# Altium project Fri3D_IRA_01.PrjPcb
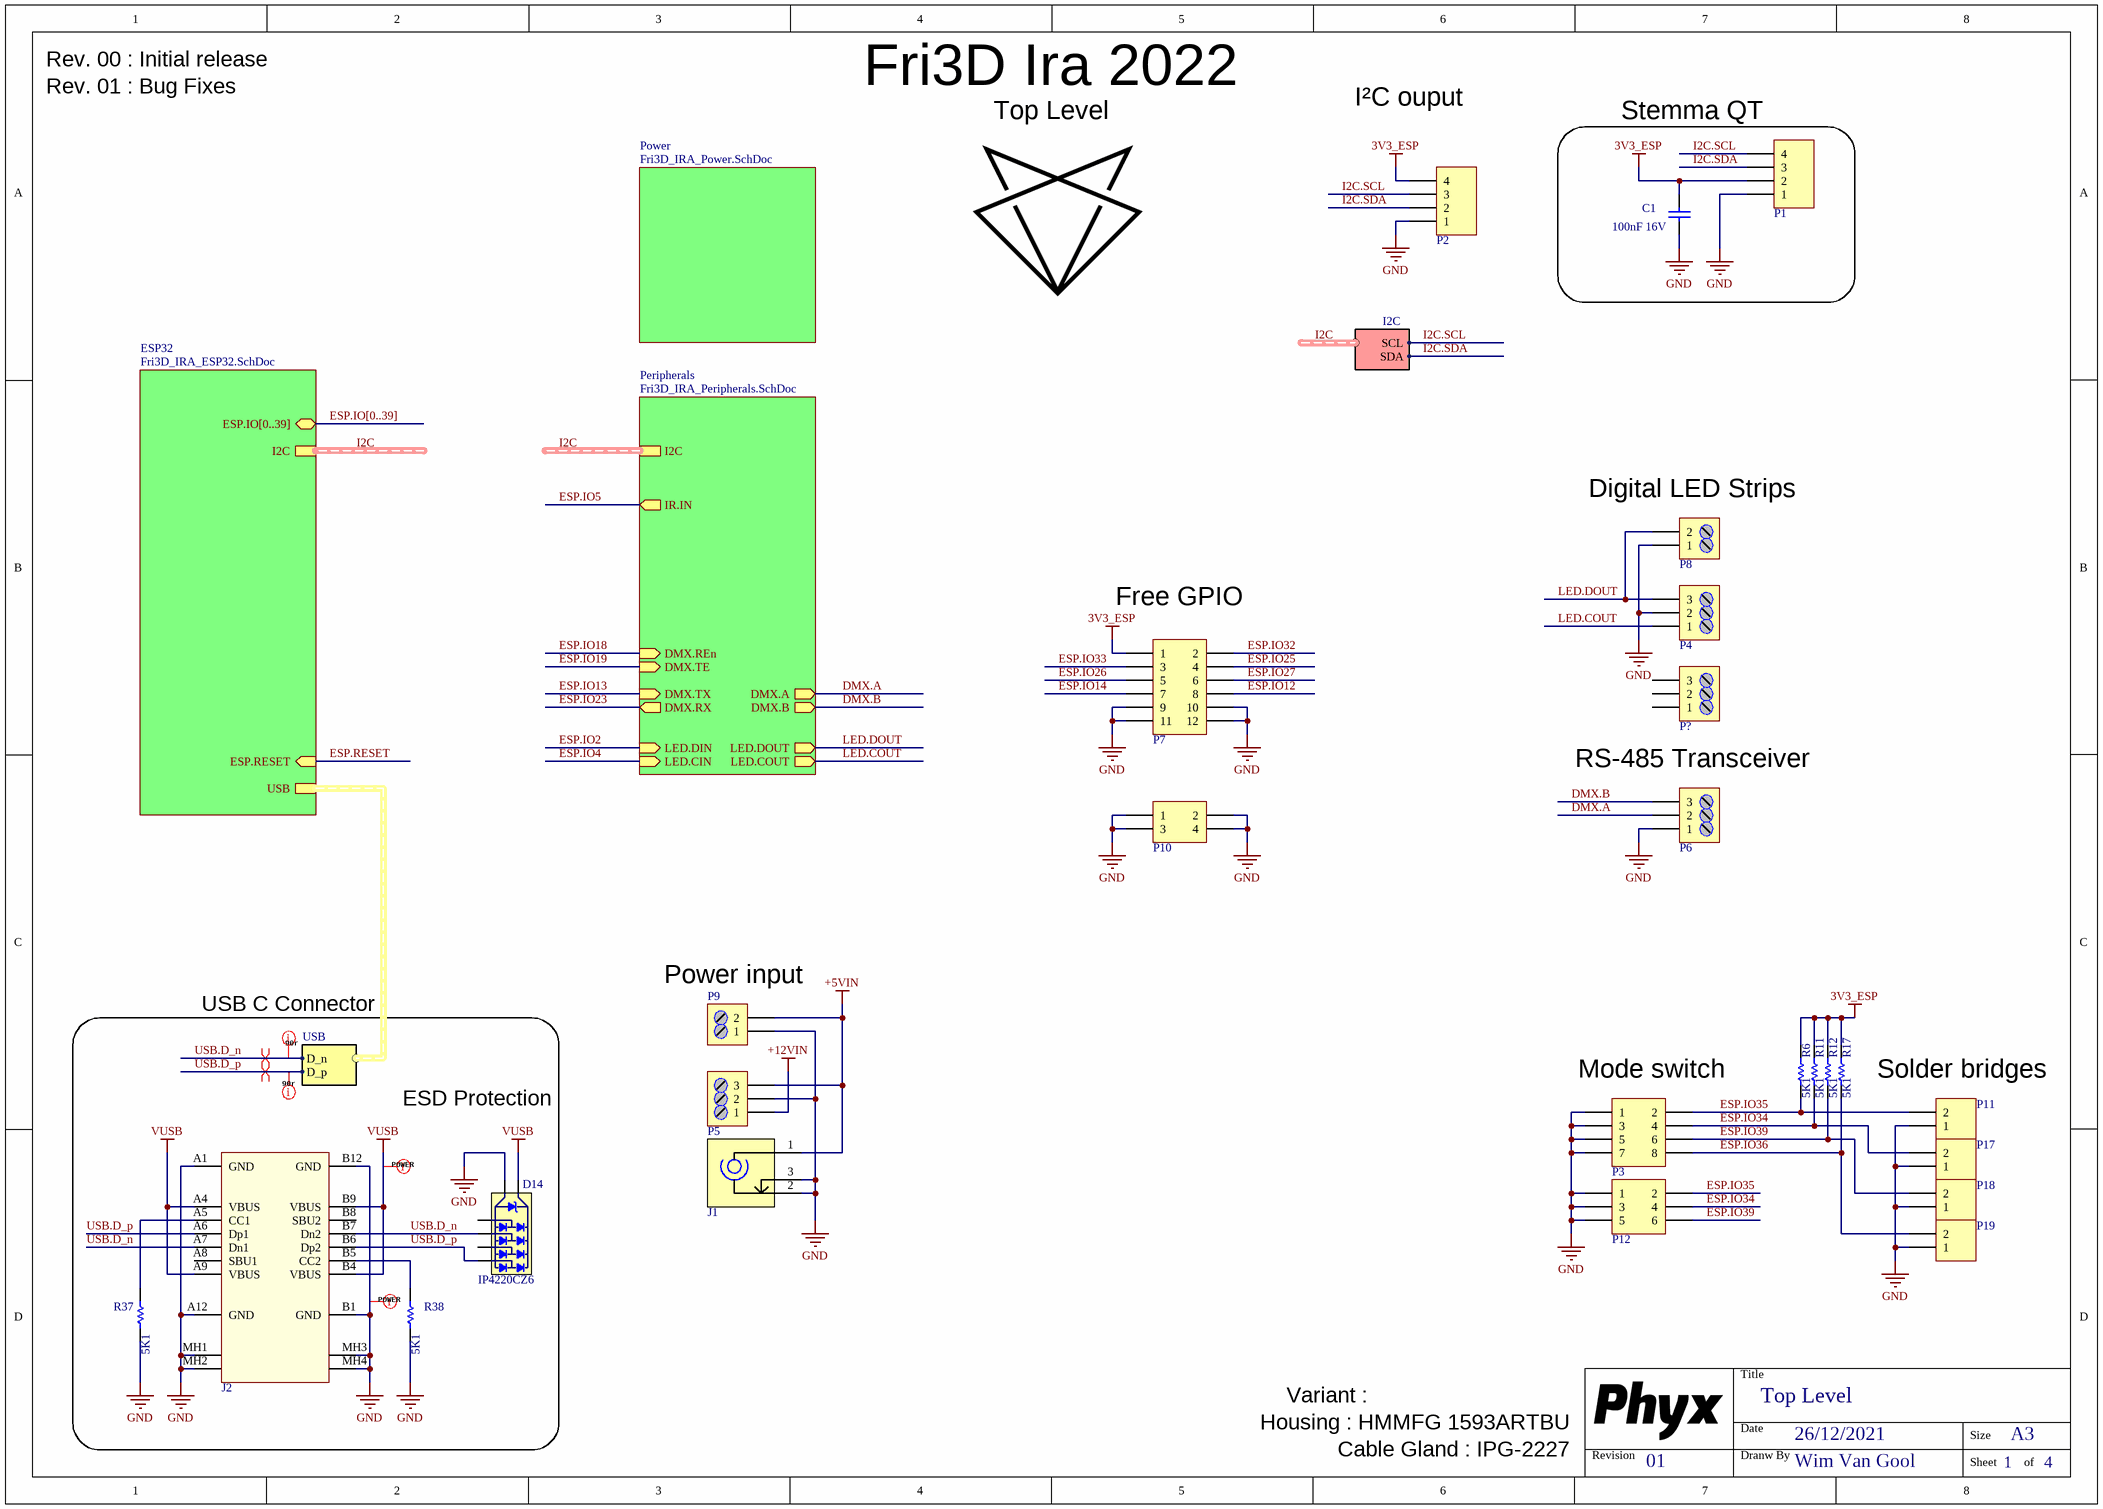
[diagram p0: Fri3D_IRA_01.SchDoc]
PCB_ENGINEER: WimVG; PCB_REV: 01; PCB_TITLE: Fri3D Ira 2022
4 sheets, 87 parts. Net scope: hierarchical (ports join the sheet entries above them; power ports are global).
Board file: Fri3D_IRA_01.PcbDoc
Sheets:
  Fri3D_IRA_01.SchDoc
    Peripherals = Fri3D_IRA_Peripherals.SchDoc
    Power = Fri3D_IRA_Power.SchDoc
    ESP32 = Fri3D_IRA_ESP32.SchDoc

## Sheet Fri3D_IRA_01.SchDoc: Top Level
size A3; Date: 26/12/2021; DrawnBy: Wim Van Gool; DocumentNumber: 1; Revision: 01; SheetNumber: 1; SheetTotal: 4

### Parts
C1  value 100nF 16V  [C0603_N]
D14  value IP4220CZ6  [NXP_SOT457]  (hidden comment: TVS Diode Dual USB)
J1  Socket RA 5.5  with 2.5 barrel  [Cliff_DC10]  (value not drawn)
J2  USB 2.0 C Reversible Receptacle Horizontal  [HRO_TYPE-C-31-M-12]  (value not drawn)
P1  Header 1.0mm RA Shrouded 4  [WE_665104131822]  (value not drawn)
P2  Header 4  [HDR1X4]  (value not drawn)
P3  Header 4x2  [HDR2X4]  (value not drawn)
P4  3 Way Screw HDR 3.5mm Rising Cage  [WE_691103110003]  (value not drawn)
P5  3 Way Screw HDR 5,08mm  [TERM_BLK-0508-3-90]  (value not drawn)
P6  3 Way Screw HDR 3.5mm Rising Cage  [WE_691103110003]  (value not drawn)
P7  Header 6X2  [HDR2X6]  (value not drawn)
P8  2 Way Screw HDR 3.5mm Rising Cage  [WE_691103110002]  (value not drawn)
P9  2 Way Screw HDR 5,08mm  [TERM_BLK-0508-2-90]  (value not drawn)
P10  Header 2X2  [HDR2X2]  (value not drawn)
P11  Easy to solder connection  [SOLDER_SW_V_1MM]  (value not drawn)
P12  Header 3X2  [HDR2X3_SMD]  (value not drawn)
P17  Easy to solder connection  [SOLDER_SW_V_1MM]  (value not drawn)
P18  Easy to solder connection  [SOLDER_SW_V_1MM]  (value not drawn)
P19  Easy to solder connection  [SOLDER_SW_V_1MM]  (value not drawn)
P?  3 Way Screw HDR 3.5mm Rising Cage  [WE_691103110003]  (value not drawn)
R6  value 5K1  [R0603_N]  (hidden comment: RESISTOR)
R11  value 5K1  [R0603_N]  (hidden comment: RESISTOR)
R12  value 5K1  [R0603_N]  (hidden comment: RESISTOR)
R17  value 5K1  [R0603_N]  (hidden comment: RESISTOR)
R37  value 5K1  [R0603_N]  (hidden comment: RESISTOR)
R38  value 5K1  [R0603_N]  (hidden comment: RESISTOR)

### Blocks framed on the sheet
Stemma QT: C1 P1

### Sub-sheets
ESP32 = Fri3D_IRA_ESP32.SchDoc: I2C (harness I2C), USB (harness USB), ESP.RESET (in), ESP.IO[0..39] (bidir)
Peripherals = Fri3D_IRA_Peripherals.SchDoc: LED.DIN (in), LED.DOUT (out), IR.IN (out), DMX.RX (out), DMX.A (out), DMX.B (out), LED.CIN (in), LED.COUT (out), DMX.TX (in), DMX.REn (in), DMX.TE (in), I2C (harness I2C)
Power = Fri3D_IRA_Power.SchDoc: no entries

### Harnesses
USB: D_p, D_n
I2C: SDA, SCL

### Nets
3V3_ESP: C1.1 P1.2 P2.4 P7.1 R6.1 R11.1 R12.1 R17.1
+5VIN: J1.1 P5.3 P9.2
+12VIN: P5.1
GND: C1.2 D14.2(GND) J1.2 J1.3 J2.A1(GND) J2.A12(GND) J2.B1(GND) J2.B12(GND) J2.MH1(Tab) J2.MH2(Tab) J2.MH3(Tab) J2.MH4(Tab) P1.1 P2.1 P3.1 P3.3 P3.5 P3.7 P4.2 P5.2 P6.1 P7.9 P7.10 P7.11 P7.12 P8.1 P9.1 P10.1 P10.2 P10.3 P10.4 P11.1 P12.1 P12.3 P12.5 P17.1 P18.1 P19.1 R37.2 R38.2
VUSB: D14.5(VBus) J2.A4(VBUS) J2.A9(VBUS) J2.B4(VBUS) J2.B9(VBUS)
DMX.A: P6.2 ; sheet Peripherals/DMX.A
DMX.B: P6.3 ; sheet Peripherals/DMX.B
ESP.IO12: P7.8
ESP.IO14: P7.7
ESP.IO25: P7.4
ESP.IO26: P7.5
ESP.IO27: P7.6
ESP.IO32: P7.2
ESP.IO33: P7.3
ESP.IO34: P3.4 P12.4 P17.2 R11.2
ESP.IO35: P3.2 P11.2 P12.2 R6.2
ESP.IO36: P3.8 P19.2 R17.2
ESP.IO39: P3.6 P12.6 P18.2 R12.2
I2C.SCL: P1.4 P2.3 ; sheet Peripherals/I2C.SCL
I2C.SDA: P1.3 P2.2 ; sheet Peripherals/I2C.SDA
LED.COUT: P4.1 ; sheet Peripherals/LED.COUT
LED.DOUT: P4.3 P8.2 ; sheet Peripherals/LED.DOUT
USB.D_n: D14.1 J2.A7(Dn1) J2.B7(Dn2) ; sheet ESP32/USB.D_n
USB.D_p: D14.6 J2.A6(Dp1) J2.B6(Dp2) ; sheet ESP32/USB.D_p
NetJ2_A5: J2.A5(CC1) R37.1
NetJ2_B5: J2.B5(CC2) R38.1

Not connected (* = marked no-connect by the designer): D14 3 4; J2 A8(SBU1) B8(SBU2); P? 1 2 3

### Buses and harness runs
bus ESP.IO[0..39] = sheet ESP32/ESP.IO[0..39]
harness I2C = sheet ESP32/I2C
harness I2C = sheet Peripherals/I2C

### Layout directives
net class 90r: USB.D_n, USB.D_p
differential pair: USB.D_n, USB.D_p
net class POWER: GND, VUSB

### Notes on the sheet
- Rev. 00 : Initial release
- Rev. 01 : Bug Fixes
- I²C ouput
- (near P8) Digital LED Strips
- (near P7) Free GPIO
- RS-485 Transceiver
- (near P9) Power input
- USB C Connector
- ESD Protection
- (near P3) Mode switch
- Solder bridges
- Variant :
- Housing : HMMFG 1593ARTBU
- Cable Gland : IPG-2227
- Title
- Revision
- Date
- Dranw By
- Size
- A3
- Sheet
- of

### Library data of the parts
C1 = CAP # 100nF 16V 0603: Capacitor Ceramic
D14 = TVS # IP4220CZ6 Dual USB: =Description; Supplier 1: Farnell; Supplier Part Number 1: 2143248
J1 = SCKT 2.5mm barrel: =Description; Value: Cliff_DC10B; Supplier 1: Farnell; Supplier Part Number 1: 224960
J2 = USB # C 2.0 RCPT TYPE-C-31-M-12: Value: TYPE-C-31-M-12; Supplier 1: China; Supplier Part Number 1: HRO TYPE-C-31-M-12; Supplier 2: LCSC; Supplier Part Number 2: C165948; Supplier 3: LCSC ALT; Supplier Part Number 3: C167321 / C319148
P1 = HDR # RA SHR 1.0mm 4way - 665104131822: Value: 665104131822; Supplier 1: Wurth; Supplier Part Number 1: 665104131822; Supplier 2: Mouser; Supplier Part Number 2: 710-665104131822
P2 = Pin Header 2.54mm 4way
P3 = Pin Header 2.54mm dual row 8way
P4 P6 P? = Terminal Block 3.5mm 3way: Supplier 1: LCSC; Description: Terminal Block 3.5mm 3way; Supplier Part Number 1: C784941; Supplier 2: Würth; Supplier Part Number 2: 691214110003
P5 = Terminal Block 5.08mm 3way: Value: PM5.08/3/90; Supplier 1: Farnell
P7 = Pin Header 2.54mm dual row 12way
P8 = Terminal Block 3.5mm 2way: Supplier 1: LCSC; Supplier Part Number 1: C784940; Description: Terminal Block 3.5mm 2way; Supplier 2: Würth; Supplier Part Number 2: 691214110002
P9 = Terminal Block 5.08mm 2way: Value: PM5.08/2/90; Supplier 1: Farnell; Supplier Part Number 1: 1131853
P10 = Pin Header 2.54mm dual row 4way
P11 P17-P19 = SOLDER SW V 1MM: Value: NO BOM
P12 = Pin Header # 2.54mm dual row 6way: Supplier 1: LCSC; Supplier Part Number 1: C192301; Supplier 2: LCSC; Supplier Part Number 2: C124390
R6 R11 R12 R17 R37 R38 = RES # 5K1 0603: Supplier 1: Farnell; Supplier Part Number 1: 2845922

## Sheet Fri3D_IRA_Peripherals.SchDoc: Peripherals
size A3; Date: 26/12/2021; DrawnBy: Wim Van Gool; DocumentNumber: 3; Revision: 01; SheetNumber: 3; SheetTotal: 4
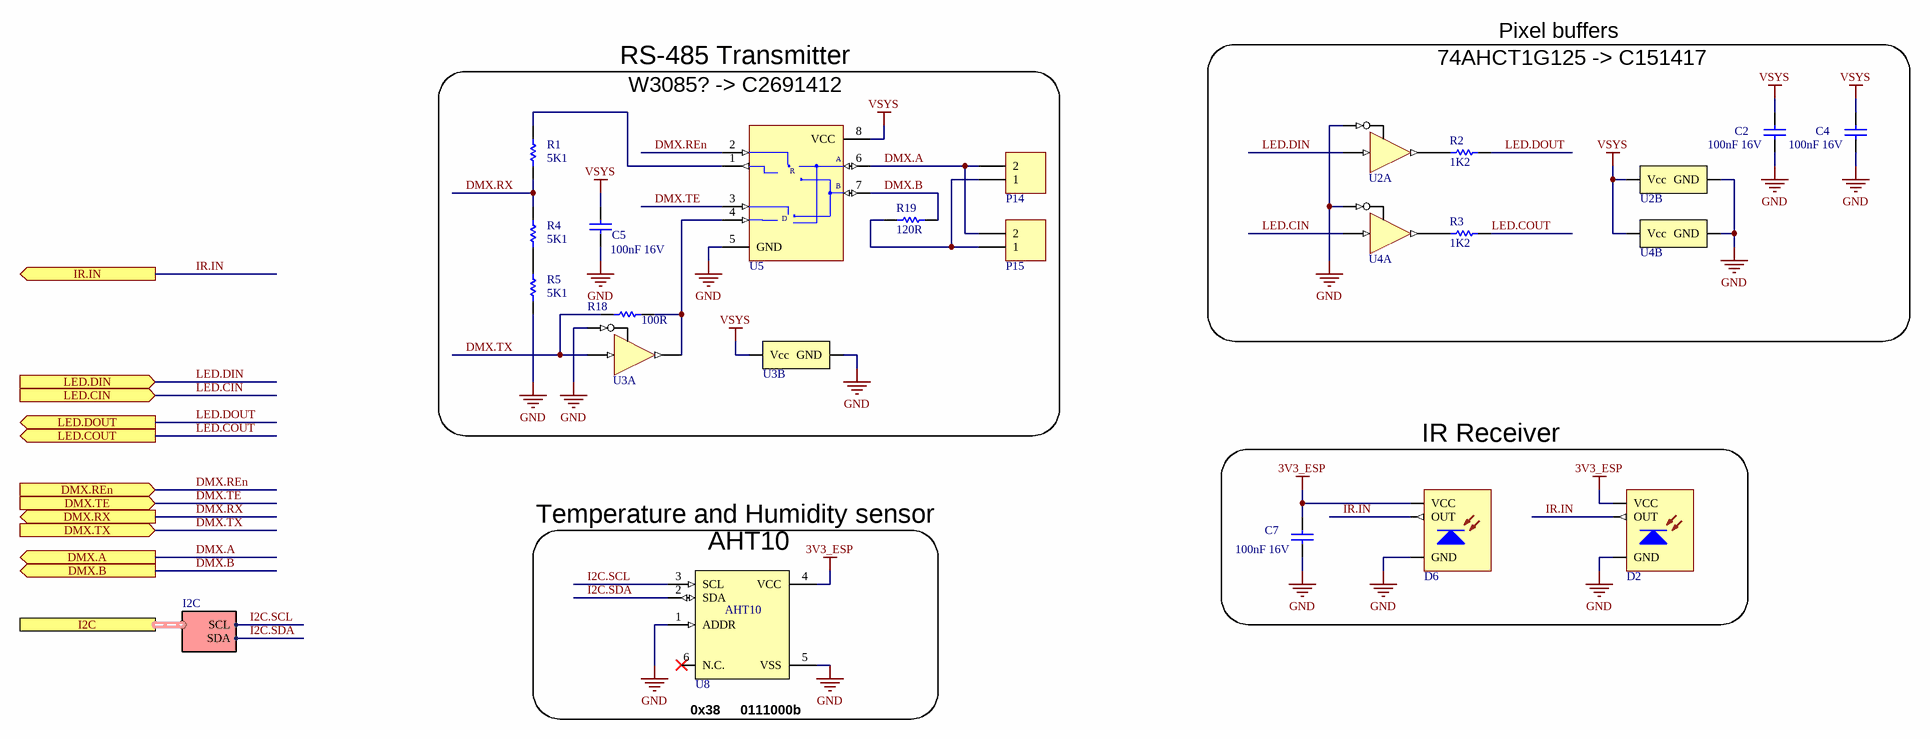
[diagram p1: Fri3D_IRA_Peripherals.SchDoc]

### Parts
C2  value 100nF 16V  [C0603_N]
C4  value 100nF 16V  [C0603_N]
C5  value 100nF 16V  [C0603_N]
C7  value 100nF 16V  [C0603_N]
D2  ZIRM-5042B-42-Z2 Infrared Receiver 38 kHz 45° 2.7-5.5V 940nm  [CHAU_ZIRM-5042B-42-Z2]  (value not drawn)
D6  IRM-3638N3F14 Infrared Receiver 38 kHz 45° 2.7-5.5V  [VIS_TSOP381x_BENT]  (value not drawn)
P14  Easy to solder connection  [SOLDER_SW_V_1MM]  (value not drawn)
P15  Header 2  [HDR1X2]  (value not drawn)
R1  value 5K1  [R0603_N]  (hidden comment: RESISTOR)
R2  value 1K2  [R0603_N]  (hidden comment: RESISTOR)
R3  value 1K2  [R0603_N]  (hidden comment: RESISTOR)
R4  value 5K1  [R0603_N]  (hidden comment: RESISTOR)
R5  value 5K1  [R0603_N]  (hidden comment: RESISTOR)
R18  value 100R  [R0603_N]  (hidden comment: RESISTOR)
R19  value 120R  [R1206]  (hidden comment: RESISTOR)
U2  SN74AHCT1G125DCKR  Buffer, Tri-State, 4.5V to 5.5V  [TI_DCK_R-PDSO-G5]  (value not drawn)  (parts A,B of 2)
U3  SN74AHCT1G125DCKR  Buffer, Tri-State, 4.5V to 5.5V  [TI_DCK_R-PDSO-G5]  (value not drawn)  (parts A,B of 2)
U4  SN74AHCT1G125DCKR  Buffer, Tri-State, 4.5V to 5.5V  [TI_DCK_R-PDSO-G5]  (value not drawn)  (parts A,B of 2)
U5  RS-485 5V Transceiver  [SOIC_N_8]  (value not drawn)
U8  AHT 10 Temperature and humidity sensor  [AHT10]  (value not drawn)

### Blocks framed on the sheet
RS-485 Transmitter: C5 P14 P15 R1 R4 R5 R18 R19 U3 U5
IR Receiver: C7 D2 D6

### Ports
DMX.A (out), DMX.B (out), DMX.REn (in), DMX.RX (out), DMX.TE (in), DMX.TX (in), I2C (harness I2C), IR.IN (out), LED.CIN (in), LED.COUT (out), LED.DIN (in), LED.DOUT (out)

### Harnesses
I2C: SDA, SCL

### Nets
3V3_ESP: C7.1 D2.3(VCC) D6.3(VCC) U8.4(VCC)
GND: C2.2 C4.2 C5.2 C7.2 D2.2(GND) D6.2(GND) R5.2 U2.1(~{OE}) U2.3(GND) U3.1(~{OE}) U3.3(GND) U4.1(~{OE}) U4.3(GND) U5.5(GND) U8.1(ADDR) U8.5(VSS)
VSYS: C2.1 C4.1 C5.1 U2.5(Vcc) U3.5(Vcc) U4.5(Vcc) U5.8(VCC)
DMX.A: P14.2 P15.2 U5.6(A) ; port DMX.A
DMX.B: R19.2 U5.7(B) ; port DMX.B
DMX.REn: U5.2(~{RE}) ; port DMX.REn
DMX.RX: R1.2 R4.1 ; port DMX.RX
DMX.TE: U5.3(DE) ; port DMX.TE
DMX.TX: R18.1 U3.2(A) ; port DMX.TX
I2C.SCL: U8.3(SCL) ; port I2C.SCL
I2C.SDA: U8.2(SDA) ; port I2C.SDA
IR.IN: D2.1(OUT) D6.1(OUT) ; port IR.IN  [project net ESP.IO5]
LED.CIN: U4.2(A) ; port LED.CIN  [project net ESP.IO4]
LED.COUT: R3.2 ; port LED.COUT
LED.DIN: U2.2(A) ; port LED.DIN  [project net ESP.IO2]
LED.DOUT: R2.2 ; port LED.DOUT
NetP14_1: P14.1 P15.1 R19.1
NetR1_1: R1.1 U5.1(RO)
NetR2_1: R2.1 U2.4(Y)
NetR3_1: R3.1 U4.4(Y)
NetR4_2: R4.2 R5.1
NetR18_2: R18.2 U3.4(Y) U5.4(DI)

Not connected (* = marked no-connect by the designer): U8 6(N.C.)*

### Notes on the sheet
- Pixel buffers
- (near U5) W3085? -> C2691412
- 74AHCT1G125 -> C151417
- Temperature and Humidity sensor
- (near U8) AHT10
- (near U8) 0x38
- (near U8) 0111000b
- Title
- Revision
- Date
- Dranw By
- Size
- A3
- Sheet
- of
- (in symbol MAX485 # RS-485 transceiver) R; D

### Library data of the parts
C2 C4 C5 C7 = CAP # 100nF 16V 0603: Capacitor Ceramic
D2 = PHO IR Rx 940nm ZIRM-5042B-42-Z2: =Description; Value: ZIRM-5042B-42-Z2; Supplier 1: LCSC; Supplier Part Number 1: C575386
D6 = PHO IR Rx RA: =Description; Value: IRM-3638N3F14; Supplier 1: LCSC; Supplier Part Number 1: C264262
P14 = SOLDER SW V 1MM: Value: NO BOM
P15 = Pin Header 2.54mm 2way
R1 R4 R5 = RES # 5K1 0603: Supplier 1: Farnell; Supplier Part Number 1: 2845922
R2 R3 = RES # 1K2 0603
R18 = RES # 100R 0603
R19 = RES # 120R 1206: Supplier 3: Generic; Supplier Part Number 3: 120R 1% 1206
U2-U4 = BUF # 1 SN74AHCT1G125DCKR: =Description; Value: SN74AHCT1G125DCKR; Supplier 1: LCSC; Supplier Part Number 1: C151417; Supplier 2: LCSC; Supplier Part Number 2: C350557
U5 = MAX485 # RS-485 transceiver: Value: MAX485ECSA+; Supplier 1: Farnell; Supplier Part Number 1: 9724524
U8 = TMP HUM # AHT10: =Description; Value: AHT10; Supplier 1: LCSC; Supplier Part Number 1: C368909

## Sheet Fri3D_IRA_Power.SchDoc: Power
size A3; Date: 26/12/2021; DrawnBy: Wim Van Gool; DocumentNumber: 4; Revision: 01; SheetNumber: 4; SheetTotal: 4
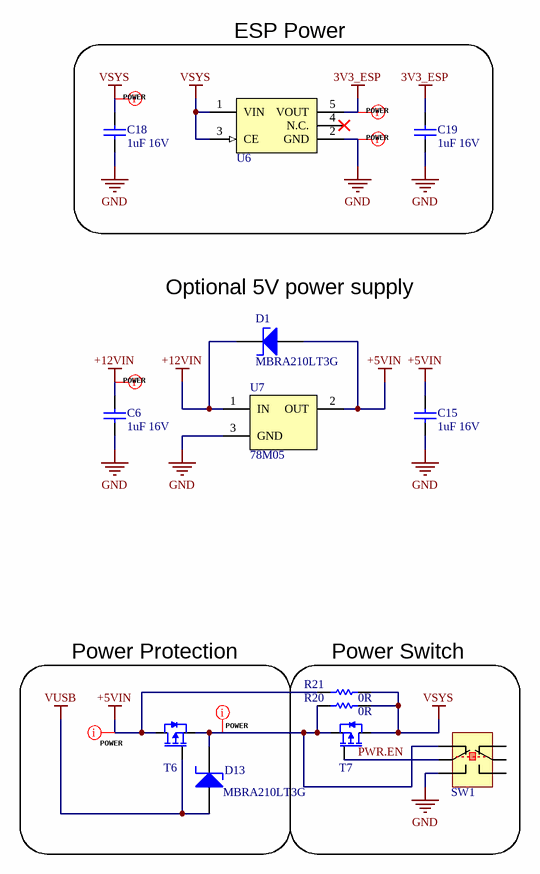
[diagram p2: Fri3D_IRA_Power.SchDoc]

### Parts
C6  value 1uF 16V  [C0603_N]  (hidden comment: CAP_CERAMIC)
C15  value 1uF 16V  [C0603_N]  (hidden comment: CAP_CERAMIC)
C18  value 1uF 16V  [C0603_N]  (hidden comment: CAP_CERAMIC)
C19  value 1uF 16V  [C0603_N]  (hidden comment: CAP_CERAMIC)
D1  MBRA210LT3G  [SMA_AC]
D13  MBRA210LT3G  [SMA_AC]
R20  value 0R  [R0603_N]  (hidden comment: RESISTOR)
R21  value 0R  [R0603_N]  (hidden comment: RESISTOR)
SW1  Mini slide switch 2P2T  [MSS22D18]  (value not drawn)
T6  -2.3A -20V P-Ch MOSFET Vgs -1V  [SOT23-3]  (value not drawn)
T7  -2.3A -20V P-Ch MOSFET Vgs -1V  [SOT23-3]  (value not drawn)
U6  3V3 LDO 700mA 50mV  [SOT23-5]  (value not drawn)
U7  78M05  [TO-252]

### Blocks framed on the sheet
ESP Power: C18 C19 U6
Power Protection: D13 T6
Power Switch: R20 R21 SW1 T7

### Nets
3V3_ESP: C19.1 U6.5(VOUT)
+5VIN: C15.1 D1.A R21.2 T6.3(D) U7.2(OUT)
+12VIN: C6.1 D1.C U7.1(IN)
GND: C6.2 C15.2 C18.2 C19.2 SW1.5 U6.2(GND) U7.3(GND)
VSYS: C18.1 R20.1 R21.1 T7.3(D) U6.1(VIN) U6.3(CE)
VUSB: D13.A T6.1(G)
PWR.EN: SW1.3 T7.1(G)
NetD13_C: D13.C R20.2 SW1.1 T6.2(S) T7.2(S)

Not connected (* = marked no-connect by the designer): SW1 2 4 6(5); U6 4(N.C.)*

### Layout directives
net class POWER: 3V3_ESP, +5VIN, +12VIN, GND, NetD13_C, VSYS

### Notes on the sheet
- (near D1) Optional 5V power supply
- Title
- Revision
- Date
- Dranw By
- Size
- A3
- Sheet
- of

### Library data of the parts
C6 C15 C18 C19 = CAP # 1uF 16V 0603: Capacitor Ceramic; Supplier 1: Farnell; Supplier Part Number 1: 2320814
D1 D13 = Schottky # MBRA210LT3G: =Description
R20 R21 = RES # 0R 0603: Supplier 1: Farnell; Supplier Part Number 1: 2447743; Supplier 3: Generic; Supplier Part Number 3: 0R 1% 0603
SW1 = SW # 2P2T mini slide MSS22D18: Value: MSS22D18; Supplier 1: LCSC; Supplier Part Number 1: C381098; Supplier 2: LCSC; Supplier Part Number 2: C145845; Supplier 3: AliExpress; Supplier Part Number 3: MSS22D18
T6 T7 = SL2301 P-Ch MOSFET -2.3A -20Vds: =Description; Value: SL2301; Supplier 1: LCSC; Supplier Part Number 1: C181086
U6 = LDO # 3V3 XC6210B33: =Designator; Value: XC6210B332MR; Supplier 1: Farnell; Supplier Part Number 1: 1057803
U7 = PWR # 78M05 5V LDO TO252: 78M05 5V 750mA LDO; Value: 78M05

## Sheet Fri3D_IRA_ESP32.SchDoc: ESP32 Module
size A3; Date: 26/12/2021; DrawnBy: Wim Van Gool; DocumentNumber: 2; Revision: 01; SheetNumber: 2; SheetTotal: 4
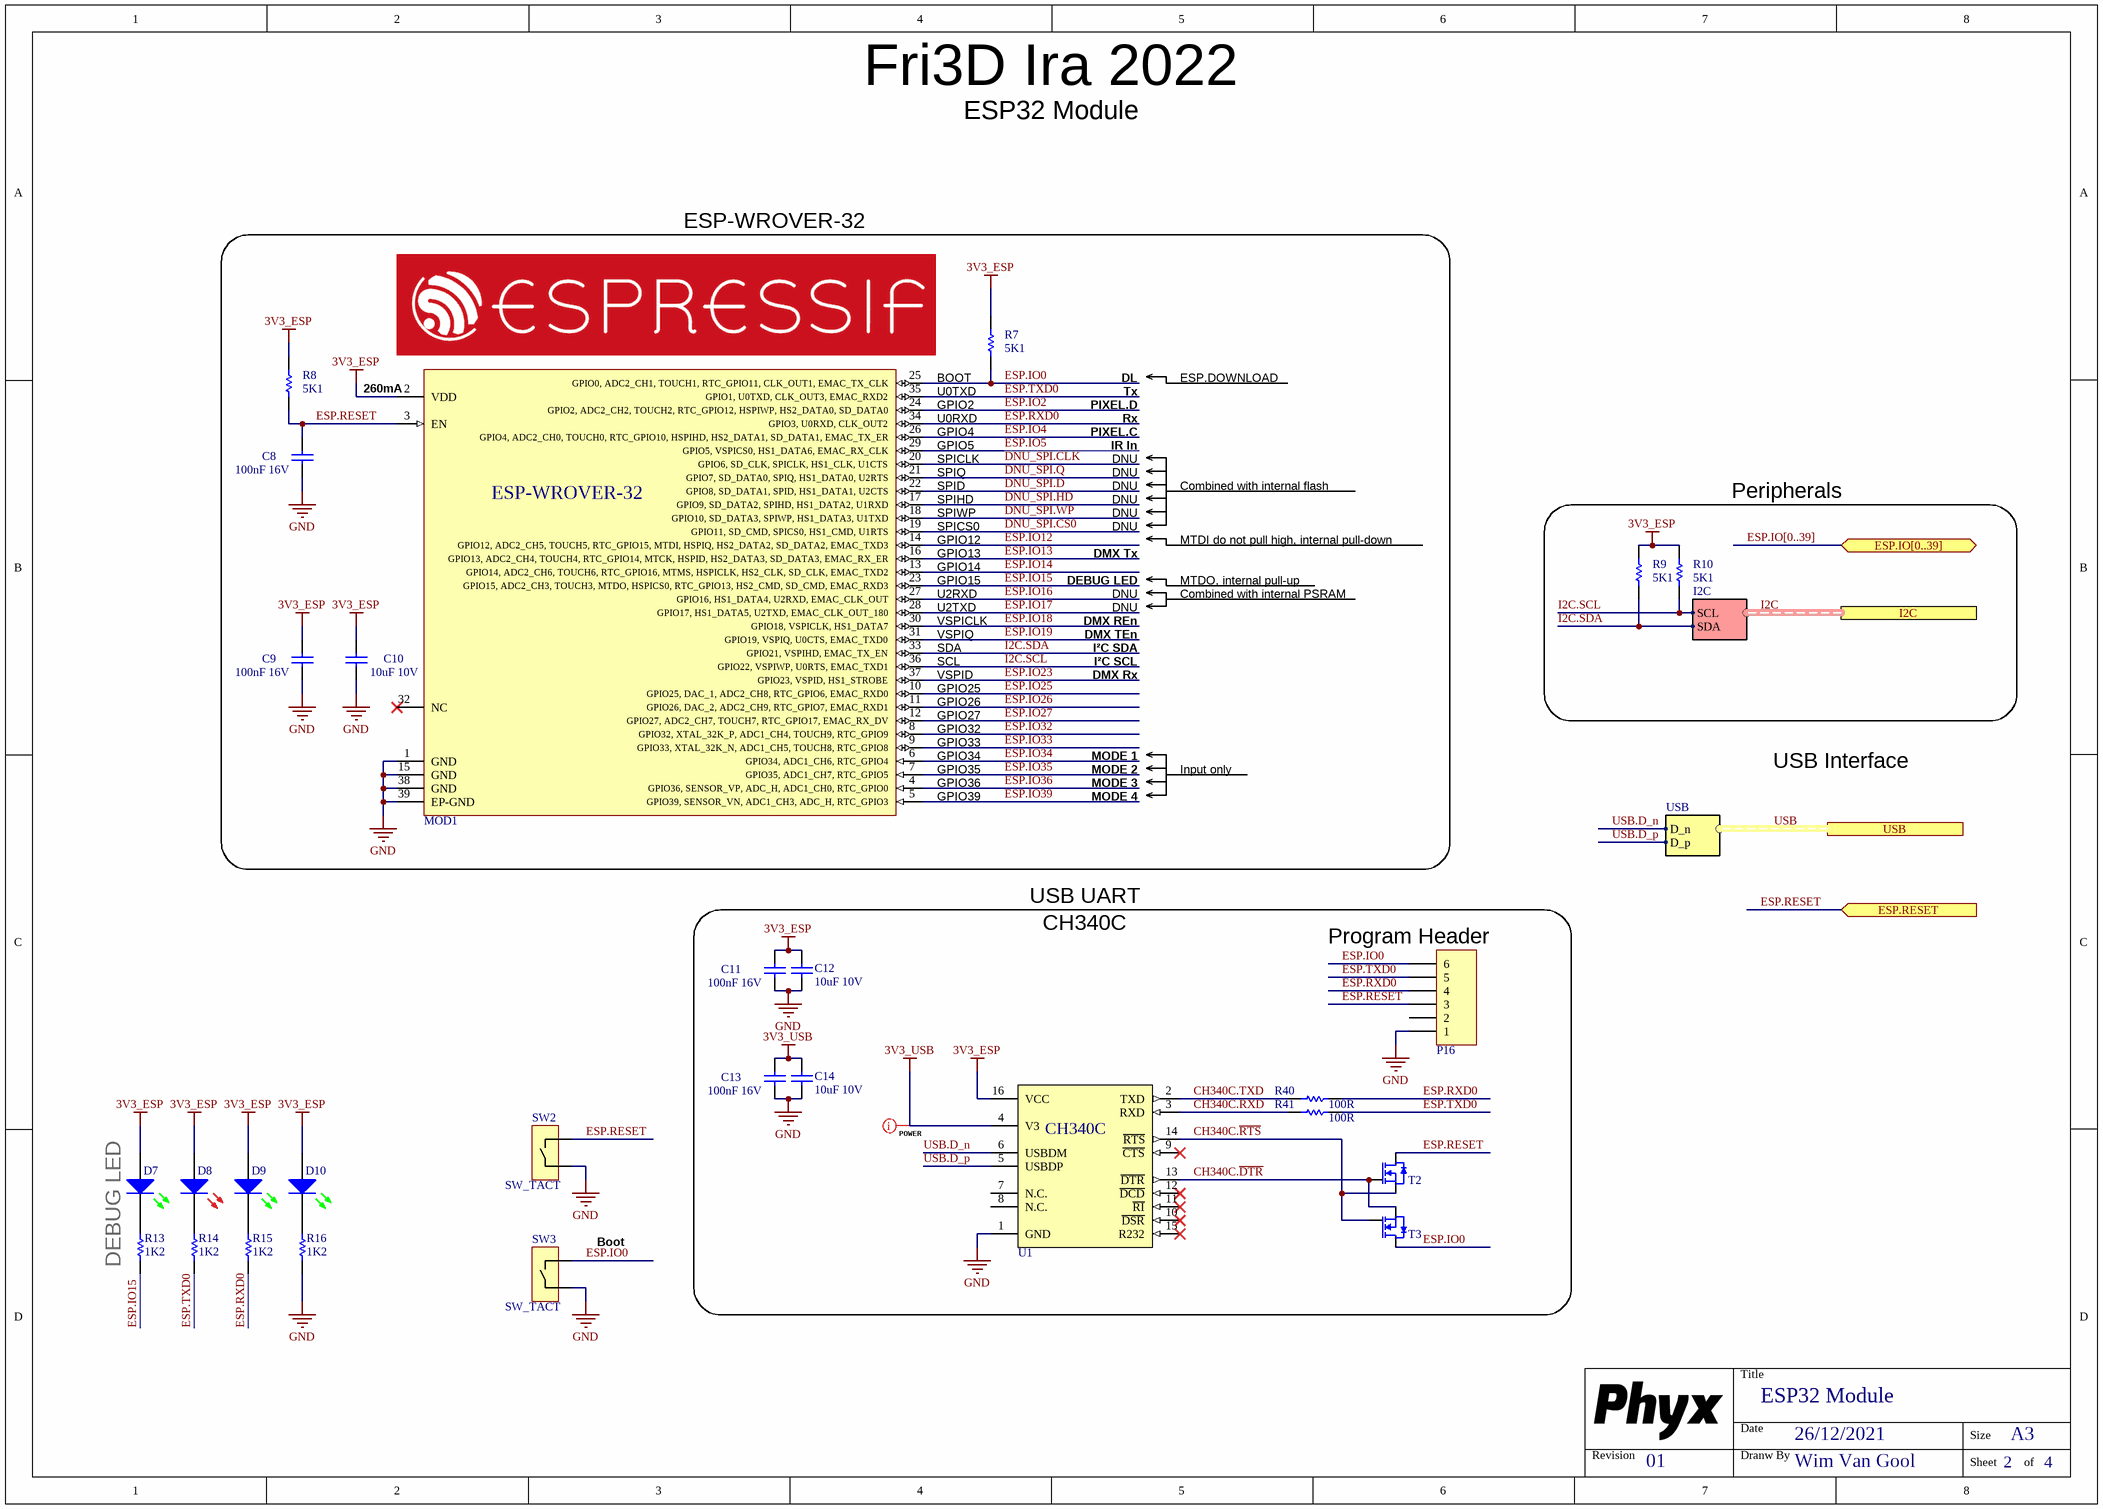
[diagram p3: Fri3D_IRA_ESP32.SchDoc]

### Parts
C8  value 100nF 16V  [C0603_N]
C9  value 100nF 16V  [C0603_N]
C10  value 10uF 10V  [C0805_N]  (hidden comment: CAP_CERAMIC)
C11  value 100nF 16V  [C0603_N]
C12  value 10uF 10V  [C0805_N]  (hidden comment: CAP_CERAMIC)
C13  value 100nF 16V  [C0603_N]
C14  value 10uF 10V  [C0805_N]  (hidden comment: CAP_CERAMIC)
D7  Default 0805 Green LED  [LED_0805_GR]  (value not drawn)
D8  Default 0805 Red LED  [LED_0805_RD]  (value not drawn)
D9  Default 0805 Green LED  [LED_0805_GR]  (value not drawn)
D10  Default 0805 Green LED  [LED_0805_GR]  (value not drawn)
MOD1  ESP-32 based ESP-WROVER-32  [ESP-WROVER-32]  (value not drawn)
P16  Header 6  [HDR1X6]  (value not drawn)
R7  value 5K1  [R0603_N]  (hidden comment: RESISTOR)
R8  value 5K1  [R0603_N]  (hidden comment: RESISTOR)
R9  value 5K1  [R0603_N]  (hidden comment: RESISTOR)
R10  value 5K1  [R0603_N]  (hidden comment: RESISTOR)
R13  value 1K2  [R0603_N]  (hidden comment: RESISTOR)
R14  value 1K2  [R0603_N]  (hidden comment: RESISTOR)
R15  value 1K2  [R0603_N]  (hidden comment: RESISTOR)
R16  value 1K2  [R0603_N]  (hidden comment: RESISTOR)
R40  value 100R  [R0603_N]  (hidden comment: RESISTOR)
R41  value 100R  [R0603_N]  (hidden comment: RESISTOR)
SW2  SW_TACT  [WE_430181038816]
SW3  SW_TACT  [WE_430181038816]
T2  0.2A N-Ch MOSFET Vgs 3.2  [SOT23-3]  (value not drawn)
T3  0.2A N-Ch MOSFET Vgs 3.2  [SOT23-3]  (value not drawn)
U1  USB to full UART with internal crystal  [SOIC_N_16]  (value not drawn)

### Blocks framed on the sheet
ESP-WROVER-32: C8-C10 MOD1 R7 R8
Peripherals: R9 R10

### Ports
ESP.IO[0..39] (bidir), ESP.RESET (in), I2C (harness I2C), USB (harness USB)

### Harnesses
I2C: SDA, SCL
USB: D_p, D_n

### Nets
3V3_ESP: C9.1 C10.1 C11.1 C12.2 D7.1(A) D8.1(A) D9.1(A) D10.1(A) MOD1.2(VDD) R7.1 R8.1 R9.1 R10.1 U1.16(VCC)
3V3_USB: C13.1 C14.2 U1.4(V3)
GND: C8.2 C9.2 C10.2 C11.2 C12.1 C13.2 C14.1 MOD1.1(GND) MOD1.15(GND) MOD1.38(GND) MOD1.39(EP-GND) P16.1 R16.2 SW2.2 SW3.2 U1.1(GND)
CH340C.~{DTR}: T2.1(G) T3.2(S) U1.13(~{DTR})
CH340C.~{RTS}: T2.2(S) T3.1(G) U1.14(~{RTS})
CH340C.RXD: R41.1 U1.3(RXD)
CH340C.TXD: R40.1 U1.2(TXD)
DNU_SPI.CLK: MOD1.20(GPIO6,_SD_CLK,_SPICLK,_HS1_CLK,_U1CTS)
DNU_SPI.CS0: MOD1.19(GPIO11,_SD_CMD,_SPICS0,_HS1_CMD,_U1RTS)
DNU_SPI.D: MOD1.22(GPIO8,_SD_DATA1,_SPID,_HS1_DATA1,_U2CTS)
DNU_SPI.HD: MOD1.17(GPIO9,_SD_DATA2,_SPIHD,_HS1_DATA2,_U1RXD)
DNU_SPI.Q: MOD1.21(GPIO7,_SD_DATA0,_SPIQ,_HS1_DATA0,_U2RTS)
DNU_SPI.WP: MOD1.18(GPIO10,_SD_DATA3,_SPIWP,_HS1_DATA3,_U1TXD)
ESP.IO0: MOD1.25(GPIO0,_ADC2_CH1,_TOUCH1,_RTC_GPIO11,_CLK_OUT1,_EMAC_TX_CLK) P16.6 R7.2 SW3.1 T3.3(D)
ESP.IO2: MOD1.24(GPIO2,_ADC2_CH2,_TOUCH2,_RTC_GPIO12,_HSPIWP,_HS2_DATA0,_SD_DATA0)
ESP.IO4: MOD1.26(GPIO4,_ADC2_CH0,_TOUCH0,_RTC_GPIO10,_HSPIHD,_HS2_DATA1,_SD_DATA1,_EMAC_TX_ER)
ESP.IO5: MOD1.29(GPIO5,_VSPICS0,_HS1_DATA6,_EMAC_RX_CLK)
ESP.IO12: MOD1.14(GPIO12,_ADC2_CH5,_TOUCH5,_RTC_GPIO15,_MTDI,_HSPIQ,_HS2_DATA2,_SD_DATA2,_EMAC_TXD3)
ESP.IO13: MOD1.16(GPIO13,_ADC2_CH4,_TOUCH4,_RTC_GPIO14,_MTCK,_HSPID,_HS2_DATA3,_SD_DATA3,_EMAC_RX_ER)  [project net DMX.TX]
ESP.IO14: MOD1.13(GPIO14,_ADC2_CH6,_TOUCH6,_RTC_GPIO16,_MTMS,_HSPICLK,_HS2_CLK,_SD_CLK,_EMAC_TXD2)
ESP.IO15: MOD1.23(GPIO15,_ADC2_CH3,_TOUCH3,_MTDO,_HSPICS0,_RTC_GPIO13,_HS2_CMD,_SD_CMD,_EMAC_RXD3) R13.2
ESP.IO16: MOD1.27(GPIO16,_HS1_DATA4,_U2RXD,_EMAC_CLK_OUT)
ESP.IO17: MOD1.28(GPIO17,_HS1_DATA5,_U2TXD,_EMAC_CLK_OUT_180)
ESP.IO18: MOD1.30(GPIO18,_VSPICLK,_HS1_DATA7)  [project net DMX.REn]
ESP.IO19: MOD1.31(GPIO19,_VSPIQ,_U0CTS,_EMAC_TXD0)  [project net DMX.TE]
ESP.IO23: MOD1.37(GPIO23,_VSPID,_HS1_STROBE)  [project net DMX.RX]
ESP.IO25: MOD1.10(GPIO25,_DAC_1,_ADC2_CH8,_RTC_GPIO6,_EMAC_RXD0)
ESP.IO26: MOD1.11(GPIO26,_DAC_2,_ADC2_CH9,_RTC_GPIO7,_EMAC_RXD1)
ESP.IO27: MOD1.12(GPIO27,_ADC2_CH7,_TOUCH7,_RTC_GPIO17,_EMAC_RX_DV)
ESP.IO32: MOD1.8(GPIO32,_XTAL_32K_P,_ADC1_CH4,_TOUCH9,_RTC_GPIO9)
ESP.IO33: MOD1.9(GPIO33,_XTAL_32K_N,_ADC1_CH5,_TOUCH8,_RTC_GPIO8)
ESP.IO34: MOD1.6(GPIO34,_ADC1_CH6,_RTC_GPIO4)
ESP.IO35: MOD1.7(GPIO35,_ADC1_CH7,_RTC_GPIO5)
ESP.IO36: MOD1.4(GPIO36,_SENSOR_VP,_ADC_H,_ADC1_CH0,_RTC_GPIO0)
ESP.IO39: MOD1.5(GPIO39,_SENSOR_VN,_ADC1_CH3,_ADC_H,_RTC_GPIO3)
ESP.RESET: C8.1 MOD1.3(EN) P16.3 R8.2 SW2.1 T2.3(D) ; port ESP.RESET
ESP.RXD0: MOD1.34(GPIO3,_U0RXD,_CLK_OUT2) P16.4 R15.2 R40.2
ESP.TXD0: MOD1.35(GPIO1,_U0TXD,_CLK_OUT3,_EMAC_RXD2) P16.5 R14.2 R41.2
I2C.SCL: MOD1.36(GPIO22,_VSPIWP,_U0RTS,_EMAC_TXD1) R10.2 ; port I2C.SCL
I2C.SDA: MOD1.33(GPIO21,_VSPIHD,_EMAC_TX_EN) R9.2 ; port I2C.SDA
USB.D_n: U1.6(USBDM) ; port USB.D_n
USB.D_p: U1.5(USBDP) ; port USB.D_p
NetD7_2: D7.2(K) R13.1
NetD8_2: D8.2(K) R14.1
NetD9_2: D9.2(K) R15.1
NetD10_2: D10.2(K) R16.1

Not connected (* = marked no-connect by the designer): MOD1 32(NC)*; P16 2; U1 7(N.C.) 8(N.C.) 9(~{CTS})* 10(~{DSR})* 11(~{RI})* 12(~{DCD})* 15(R232)*

### Buses and harness runs
bus ESP.IO[0..39] = port ESP.IO[0..39]
harness I2C = port I2C
harness USB = port USB

### Layout directives
net class POWER: 3V3_USB

### Notes on the sheet
- BOOT
- U0TXD
- DL
- Tx
- ESP.DOWNLOAD
- (near MOD1) 260mA
- (near MOD1) SPICLK
- U0RXD
- GPIO2
- (near MOD1) GPIO4
- (near MOD1) GPIO5
- IR In
- Rx
- DNU
- PIXEL.D
- PIXEL.C
- (near MOD1) SPIQ
- (near MOD1) SPID
- (near MOD1) SPIHD
- (near MOD1) SPIWP
- (near MOD1) SPICS0
- Combined with internal flash
- (near MOD1) U2RXD
- (near MOD1) GPIO12
- (near MOD1) GPIO13
- (near MOD1) GPIO14
- (near MOD1) GPIO15
- DEBUG LED
- DMX Tx
- MTDI do not pull high, internal pull-down
- MTDO, internal pull-up
- Combined with internal PSRAM
- (near MOD1) SDA
- (near MOD1) SCL
- (near MOD1) VSPICLK
- (near MOD1) VSPIQ
- (near MOD1) U2TXD
- I²C SDA
- I²C SCL
- DMX REn
- DMX TEn
- (near MOD1) VSPID
- (near MOD1) GPIO25
- (near MOD1) GPIO26
- (near MOD1) GPIO27
- (near MOD1) GPIO32
- DMX Rx
- (near MOD1) GPIO34
- (near MOD1) GPIO35
- (near MOD1) GPIO36
- (near MOD1) GPIO39
- (near MOD1) GPIO33
- MODE 1
- MODE 2
- MODE 3
- MODE 4
- Input only
- USB Interface
- USB UART
- CH340C
- (near P16) Program Header
- (near SW3) Boot
- Title
- Revision
- Date
- Dranw By
- Size
- A3
- Sheet
- of

### Library data of the parts
C8 C9 C11 C13 = CAP # 100nF 16V 0603: Capacitor Ceramic
C10 C12 C14 = CAP # 10uF 10V 0805: Capacitor Ceramic; Supplier 1: Farnell; Supplier Part Number 1: 2320859
D7 D9 D10 = LED # Green 0805: =Description; Supplier 1: Farnell; Supplier Part Number 1: 2099239
D8 = LED # Red 0805: =Description; Supplier 1: Farnell; Supplier Part Number 1: 2099236
MOD1 = WiFi # MOD ESP-WROVER-32: Value: ESP-WROVER-32; Supplier 1: Espressif; Supplier Part Number 1: ESP-WROVER-32
P16 = Pin Header 2.54mm 6way
R7-R10 = RES # 5K1 0603: Supplier 1: Farnell; Supplier Part Number 1: 2845922
R13-R16 = RES # 1K2 0603
R40 R41 = RES # 100R 0603
SW2 SW3 = SW # TACT small 4.5x4.5mm SMD WS-TASV
T2 T3 = BSS138 N-Ch MOSFET 0.2A 3.2Vgs 60Vds: Value: BSS138; Supplier 1: Farnell; Supplier Part Number 1: 2432717
U1 = CH340C # UCB UART: =Description; Value: CH340C; Supplier 1: LCSC; Supplier Part Number 1: C84681

## Nets that join several sheets
3V3_ESP: Fri3D_IRA_01 (8 pins), Fri3D_IRA_Peripherals (C7.1 D2.3 D6.3 U8.4), Fri3D_IRA_Power (C19.1 U6.5), Fri3D_IRA_ESP32 (14 pins)
+5VIN: Fri3D_IRA_01 (J1.1 P5.3 P9.2), Fri3D_IRA_Power (5 pins)
+12VIN: Fri3D_IRA_01 (P5.1), Fri3D_IRA_Power (C6.1 D1.C U7.1)
GND: Fri3D_IRA_01 (40 pins), Fri3D_IRA_Peripherals (16 pins), Fri3D_IRA_Power (7 pins), Fri3D_IRA_ESP32 (16 pins)
VSYS: Fri3D_IRA_Peripherals (7 pins), Fri3D_IRA_Power (6 pins)
VUSB: Fri3D_IRA_01 (5 pins), Fri3D_IRA_Power (D13.A T6.1)
DMX.A: Fri3D_IRA_01 (P6.2), Fri3D_IRA_Peripherals (P14.2 P15.2 U5.6)
DMX.B: Fri3D_IRA_01 (P6.3), Fri3D_IRA_Peripherals (R19.2 U5.7)
DMX.REn: Fri3D_IRA_Peripherals (U5.2), Fri3D_IRA_ESP32 (MOD1.30)
DMX.RX: Fri3D_IRA_Peripherals (R1.2 R4.1), Fri3D_IRA_ESP32 (MOD1.37)
DMX.TE: Fri3D_IRA_Peripherals (U5.3), Fri3D_IRA_ESP32 (MOD1.31)
DMX.TX: Fri3D_IRA_Peripherals (R18.1 U3.2), Fri3D_IRA_ESP32 (MOD1.16)
ESP.IO2: Fri3D_IRA_Peripherals (U2.2), Fri3D_IRA_ESP32 (MOD1.24)
ESP.IO4: Fri3D_IRA_Peripherals (U4.2), Fri3D_IRA_ESP32 (MOD1.26)
ESP.IO5: Fri3D_IRA_Peripherals (D2.1 D6.1), Fri3D_IRA_ESP32 (MOD1.29)
ESP.IO12: Fri3D_IRA_01 (P7.8), Fri3D_IRA_ESP32 (MOD1.14)
ESP.IO14: Fri3D_IRA_01 (P7.7), Fri3D_IRA_ESP32 (MOD1.13)
ESP.IO25: Fri3D_IRA_01 (P7.4), Fri3D_IRA_ESP32 (MOD1.10)
ESP.IO26: Fri3D_IRA_01 (P7.5), Fri3D_IRA_ESP32 (MOD1.11)
ESP.IO27: Fri3D_IRA_01 (P7.6), Fri3D_IRA_ESP32 (MOD1.12)
ESP.IO32: Fri3D_IRA_01 (P7.2), Fri3D_IRA_ESP32 (MOD1.8)
ESP.IO33: Fri3D_IRA_01 (P7.3), Fri3D_IRA_ESP32 (MOD1.9)
ESP.IO34: Fri3D_IRA_01 (P3.4 P12.4 P17.2 R11.2), Fri3D_IRA_ESP32 (MOD1.6)
ESP.IO35: Fri3D_IRA_01 (P3.2 P11.2 P12.2 R6.2), Fri3D_IRA_ESP32 (MOD1.7)
ESP.IO36: Fri3D_IRA_01 (P3.8 P19.2 R17.2), Fri3D_IRA_ESP32 (MOD1.4)
ESP.IO39: Fri3D_IRA_01 (P3.6 P12.6 P18.2 R12.2), Fri3D_IRA_ESP32 (MOD1.5)
I2C.SCL: Fri3D_IRA_01 (P1.4 P2.3), Fri3D_IRA_Peripherals (U8.3), Fri3D_IRA_ESP32 (MOD1.36 R10.2)
I2C.SDA: Fri3D_IRA_01 (P1.3 P2.2), Fri3D_IRA_Peripherals (U8.2), Fri3D_IRA_ESP32 (MOD1.33 R9.2)
LED.COUT: Fri3D_IRA_01 (P4.1), Fri3D_IRA_Peripherals (R3.2)
LED.DOUT: Fri3D_IRA_01 (P4.3 P8.2), Fri3D_IRA_Peripherals (R2.2)
USB.D_n: Fri3D_IRA_01 (D14.1 J2.A7 J2.B7), Fri3D_IRA_ESP32 (U1.6)
USB.D_p: Fri3D_IRA_01 (D14.6 J2.A6 J2.B6), Fri3D_IRA_ESP32 (U1.5)

## Assembly variants
Default: not fitted C6 C15 D1 D6 D13 J1 P1 P2 P5 P7 P8 P10 P16 R18 R20 SW1 T6 T7 U7
Minimal: not fitted C1 C4 C5 C6 C11 C12 C13 C14 C15 D1 D6 D8 D9 D13 D14 J1 J2 P1 P2 P4 P5 P6 P7 P10 P14 P15 R1 R3 R4 R5 R9 R10 R14 R15 R18 R19 R20 R37 R38 R40 R41 SW1 SW2 SW3 T2 T3 T6 T7 U1 U3 U4 U5 U7 U8
Development: not fitted D6 J1 P2 P8 P9 P16 R18 R20 R21
Minimal_DMX: not fitted C1 C4 C6 C11 C12 C13 C14 C15 D1 D6 D8 D9 D13 D14 J1 J2 P1 P2 P4 P5 P6 P7 P10 R1 R3 R4 R5 R9 R10 R14 R15 R18 R20 R37 R38 R40 R41 SW1 SW2 SW3 T2 T3 T6 T7 U1 U4 U7 U8